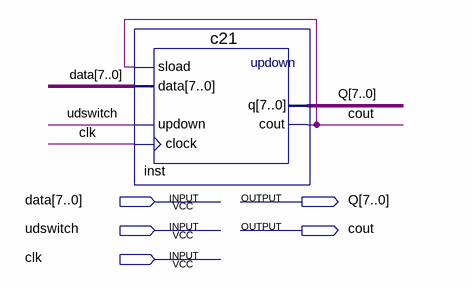
[diagram p0: schematic sheet]
// Quartus schematic p2.bdf as structural Verilog: 1 symbols, 5 pins
module p2 (
  input  [7:0] data,
  input  udswitch,
  input  clk,
  output [7:0] Q,
  output cout
);

  c21 inst (.sload(cout), .data(data), .updown(udswitch), .clock(clk), .cout(cout), .q(Q));
endmodule
